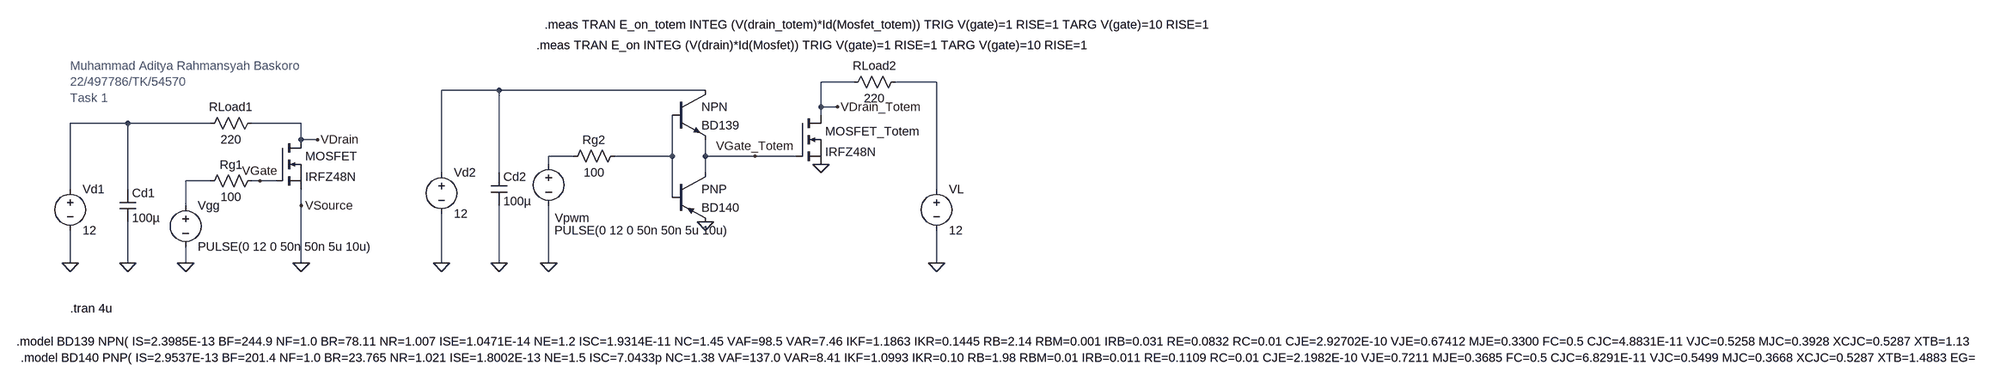
[diagram p0: schematic TotemPole_497786.asc]
TotemPole_497786.asc, the LTspice schematic file:
Version 4
SHEET 1 5304 680
WIRE 1296 0 1232 0
WIRE 1456 0 1376 0
WIRE 608 16 496 16
WIRE 1008 16 608 16
WIRE 1232 48 1232 0
WIRE 1264 48 1232 48
WIRE 1232 64 1232 48
WIRE -112 80 -224 80
WIRE 48 80 -112 80
WIRE 224 80 128 80
WIRE 224 112 224 80
WIRE 256 112 224 112
WIRE 752 144 704 144
WIRE 944 144 944 64
WIRE 944 144 832 144
WIRE 1008 144 1008 112
WIRE 1104 144 1008 144
WIRE 1184 144 1104 144
WIRE 704 160 704 144
WIRE 496 176 496 16
WIRE 608 176 608 16
WIRE 1008 176 1008 144
WIRE 48 192 0 192
WIRE 144 192 128 192
WIRE 176 192 144 192
WIRE -224 208 -224 80
WIRE -112 208 -112 80
WIRE 1456 208 1456 0
WIRE 944 224 944 144
WIRE 0 240 0 192
WIRE 224 240 224 208
WIRE -224 352 -224 288
WIRE -112 352 -112 272
WIRE 0 352 0 320
WIRE 224 352 224 240
WIRE 496 352 496 256
WIRE 608 352 608 240
WIRE 704 352 704 240
WIRE 1456 352 1456 288
FLAG 224 352 0
FLAG 0 352 0
FLAG -112 352 0
FLAG -224 352 0
FLAG 144 192 VGate
FLAG 256 112 VDrain
FLAG 1456 352 0
FLAG 1232 160 0
FLAG 1008 272 0
FLAG 704 352 0
FLAG 608 352 0
FLAG 1104 144 VGate_Totem
FLAG 1264 48 VDrain_Totem
FLAG 496 352 0
FLAG 224 240 VSource
SYMBOL nmos 176 112 R0
SYMATTR InstName MOSFET
SYMATTR Value IRFZ48N
SYMBOL voltage -224 192 R0
WINDOW 123 0 0 Left 0
WINDOW 39 0 0 Left 0
SYMATTR InstName Vd1
SYMATTR Value 12
SYMBOL voltage 0 224 R0
WINDOW 123 0 0 Left 0
WINDOW 39 0 0 Left 0
SYMATTR InstName Vgg
SYMATTR Value PULSE(0 12 0 50n 50n 5u 10u)
SYMBOL res 144 176 R90
WINDOW 0 0 56 VBottom 2
WINDOW 3 32 56 VTop 2
SYMATTR InstName Rg1
SYMATTR Value 100
SYMBOL res 144 64 R90
WINDOW 0 0 56 VBottom 2
WINDOW 3 32 56 VTop 2
SYMATTR InstName RLoad1
SYMATTR Value 220
SYMBOL cap -128 208 R0
SYMATTR InstName Cd1
SYMATTR Value 100µ
SYMBOL npn 944 16 R0
SYMATTR InstName NPN
SYMATTR Value BD139
SYMBOL pnp 944 176 R0
SYMATTR InstName PNP
SYMATTR Value BD140
SYMBOL nmos 1184 64 R0
SYMATTR InstName MOSFET_Totem
SYMATTR Value IRFZ48N
SYMBOL res 848 128 R90
WINDOW 0 0 56 VBottom 2
WINDOW 3 32 56 VTop 2
SYMATTR InstName Rg2
SYMATTR Value 100
SYMBOL res 1392 -16 R90
WINDOW 0 0 56 VBottom 2
WINDOW 3 32 56 VTop 2
SYMATTR InstName RLoad2
SYMATTR Value 220
SYMBOL voltage 704 144 R0
WINDOW 0 12 120 Left 2
WINDOW 3 11 144 Left 2
WINDOW 123 0 0 Left 0
WINDOW 39 0 0 Left 0
SYMATTR InstName Vpwm
SYMATTR Value PULSE(0 12 0 50n 50n 5u 10u)
SYMBOL voltage 1456 192 R0
WINDOW 123 0 0 Left 0
WINDOW 39 0 0 Left 0
SYMATTR InstName VL
SYMATTR Value 12
SYMBOL voltage 496 160 R0
WINDOW 123 0 0 Left 0
WINDOW 39 0 0 Left 0
SYMATTR InstName Vd2
SYMATTR Value 12
SYMBOL cap 592 176 R0
SYMATTR InstName Cd2
SYMATTR Value 100µ
TEXT -224 440 Left 2 !.tran 4u
TEXT -328 504 Left 2 !.model BD139 NPN( IS=2.3985E-13 BF=244.9 NF=1.0 BR=78.11 NR=1.007 ISE=1.0471E-14 NE=1.2 ISC=1.9314E-11 NC=1.45 VAF=98.5 VAR=7.46 IKF=1.1863 IKR=0.1445 RB=2.14 RBM=0.001 IRB=0.031 RE=0.0832 RC=0.01 CJE=2.92702E-10 VJE=0.67412 MJE=0.3300 FC=0.5 CJC=4.8831E-11 VJC=0.5258 MJC=0.3928 XCJC=0.5287 XTB=1.1398 EG=1.2105 XTI=3.0 Vceo=80 Icrating=3 mfg=fairchild)
TEXT -320 536 Left 2 !.model BD140 PNP( IS=2.9537E-13 BF=201.4 NF=1.0 BR=23.765 NR=1.021 ISE=1.8002E-13 NE=1.5 ISC=7.0433p NC=1.38 VAF=137.0 VAR=8.41 IKF=1.0993 IKR=0.10 RB=1.98 RBM=0.01 IRB=0.011 RE=0.1109 RC=0.01 CJE=2.1982E-10 VJE=0.7211 MJE=0.3685 FC=0.5 CJC=6.8291E-11 VJC=0.5499 MJC=0.3668 XCJC=0.5287 XTB=1.4883 EG=1.2343 XTI=3.0 Vceo=80 Icrating=3 mfg=fairchild)
TEXT -224 -32 Left 2 ;Muhammad Aditya Rahmansyah Baskoro\n22/497786/TK/54570\nTask 1
TEXT 680 -72 Left 2 !.meas TRAN E_on INTEG (V(drain)*Id(Mosfet)) TRIG V(gate)=1 RISE=1 TARG V(gate)=10 RISE=1
TEXT 696 -112 Left 2 !.meas TRAN E_on_totem INTEG (V(drain_totem)*Id(Mosfet_totem)) TRIG V(gate)=1 RISE=1 TARG V(gate)=10 RISE=1

The netlist it stands for:
* TotemPole_497786.asc
MOSFET VDrain VGate 0 0 IRFZ48N
Vd1 N003 0 12
Vgg N006 0 PULSE(0 12 0 50n 50n 5u 10u)
Rg1 VGate N006 100
RLoad1 VDrain N003 220
Cd1 N003 0 100µ
Q§NPN N002 N005 VGate_Totem 0 BD139
Q§PNP VGate_Totem N005 0 0 BD140
MOSFET_Totem VDrain_Totem VGate_Totem 0 0 IRFZ48N
Rg2 N005 N004 100
RLoad2 N001 VDrain_Totem 220
Vpwm N004 0 PULSE(0 12 0 50n 50n 5u 10u)
VL N001 0 12
Vd2 N002 0 12
Cd2 N002 0 100µ
.model NPN NPN
.model PNP PNP
.lib standard.bjt
.model NMOS NMOS
.model PMOS PMOS
.lib standard.mos
.tran 4u
.model BD139 NPN( IS=2.3985E-13 BF=244.9 NF=1.0 BR=78.11 NR=1.007 ISE=1.0471E-14 NE=1.2 ISC=1.9314E-11 NC=1.45 VAF=98.5 VAR=7.46 IKF=1.1863 IKR=0.1445 RB=2.14 RBM=0.001 IRB=0.031 RE=0.0832 RC=0.01 CJE=2.92702E-10 VJE=0.67412 MJE=0.3300 FC=0.5 CJC=4.8831E-11 VJC=0.5258 MJC=0.3928 XCJC=0.5287 XTB=1.1398 EG=1.2105 XTI=3.0 Vceo=80 Icrating=3 mfg=fairchild)
.model BD140 PNP( IS=2.9537E-13 BF=201.4 NF=1.0 BR=23.765 NR=1.021 ISE=1.8002E-13 NE=1.5 ISC=7.0433p NC=1.38 VAF=137.0 VAR=8.41 IKF=1.0993 IKR=0.10 RB=1.98 RBM=0.01 IRB=0.011 RE=0.1109 RC=0.01 CJE=2.1982E-10 VJE=0.7211 MJE=0.3685 FC=0.5 CJC=6.8291E-11 VJC=0.5499 MJC=0.3668 XCJC=0.5287 XTB=1.4883 EG=1.2343 XTI=3.0 Vceo=80 Icrating=3 mfg=fairchild)
* Muhammad Aditya Rahmansyah Baskoro
* 22/497786/TK/54570
* Task 1
.meas TRAN E_on INTEG (V(drain)*Id(Mosfet)) TRIG V(gate)=1 RISE=1 TARG V(gate)=10 RISE=1
.meas TRAN E_on_totem INTEG (V(drain_totem)*Id(Mosfet_totem)) TRIG V(gate)=1 RISE=1 TARG V(gate)=10 RISE=1
.backanno
.end